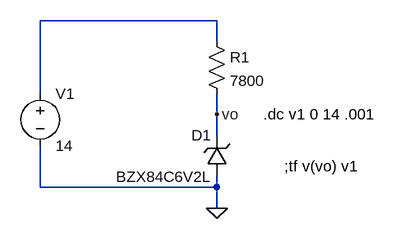
[diagram p0: schematic Draft2.asc]
Draft2.asc, the LTspice schematic file:
Version 4
SHEET 1 880 680
WIRE 208 0 -64 0
WIRE 208 32 208 0
WIRE -64 112 -64 0
WIRE 208 144 208 112
WIRE 208 176 208 144
WIRE -64 256 -64 192
WIRE 208 256 208 240
WIRE 208 256 -64 256
WIRE 208 288 208 256
FLAG 208 288 0
FLAG 208 144 vo
SYMBOL zener 224 240 R180
WINDOW 0 24 64 Left 2
WINDOW 3 24 0 Left 2
SYMATTR InstName D1
SYMATTR Value BZX84C6V2L
SYMBOL res 192 16 R0
SYMATTR InstName R1
SYMATTR Value 7800
SYMBOL voltage -64 96 R0
WINDOW 123 0 0 Left 2
WINDOW 39 0 0 Left 2
SYMATTR InstName V1
SYMATTR Value 14
TEXT 312 224 Left 2 !;tf v(vo) v1
TEXT 280 144 Left 2 !.dc v1 0 14 .001

The netlist it stands for:
* Draft2.asc
D1 0 vo BZX84C6V2L
R1 N001 vo 7800
V1 N001 0 14
.model D D
.lib standard.dio
;tf v(vo) v1
.dc v1 0 14 .001
.backanno
.end